# Altium schematic sheet NNP-DWG-125-001-000 PG4 Schematic Drawing Pg4.SchDoc: 1
size B; Address1: 300 Artini St.; Address2: Oberlin, OH  44074; DocumentNumber: 51-2002-01; Revision: 04; SheetNumber: 4; SheetTotal: 8; PageSetup: Record=PageOptions|CenterHorizontal=True|CenterVertical=True|PrintScale=1.09|XCorrection=1.00|YCorrection=1.00|PrintKind=0|BorderSize=5000000|LeftOffset=0|BottomOffset=0|Orientation=2|PaperLength=4318|PaperWidth=2794|Scale=100|PaperSource=7|PrintQuality=-3|MediaType=1|DitherType=10|PrintScaleMode=1|PaperKind=11" x 17"|PaperIndex=17; DocName: **
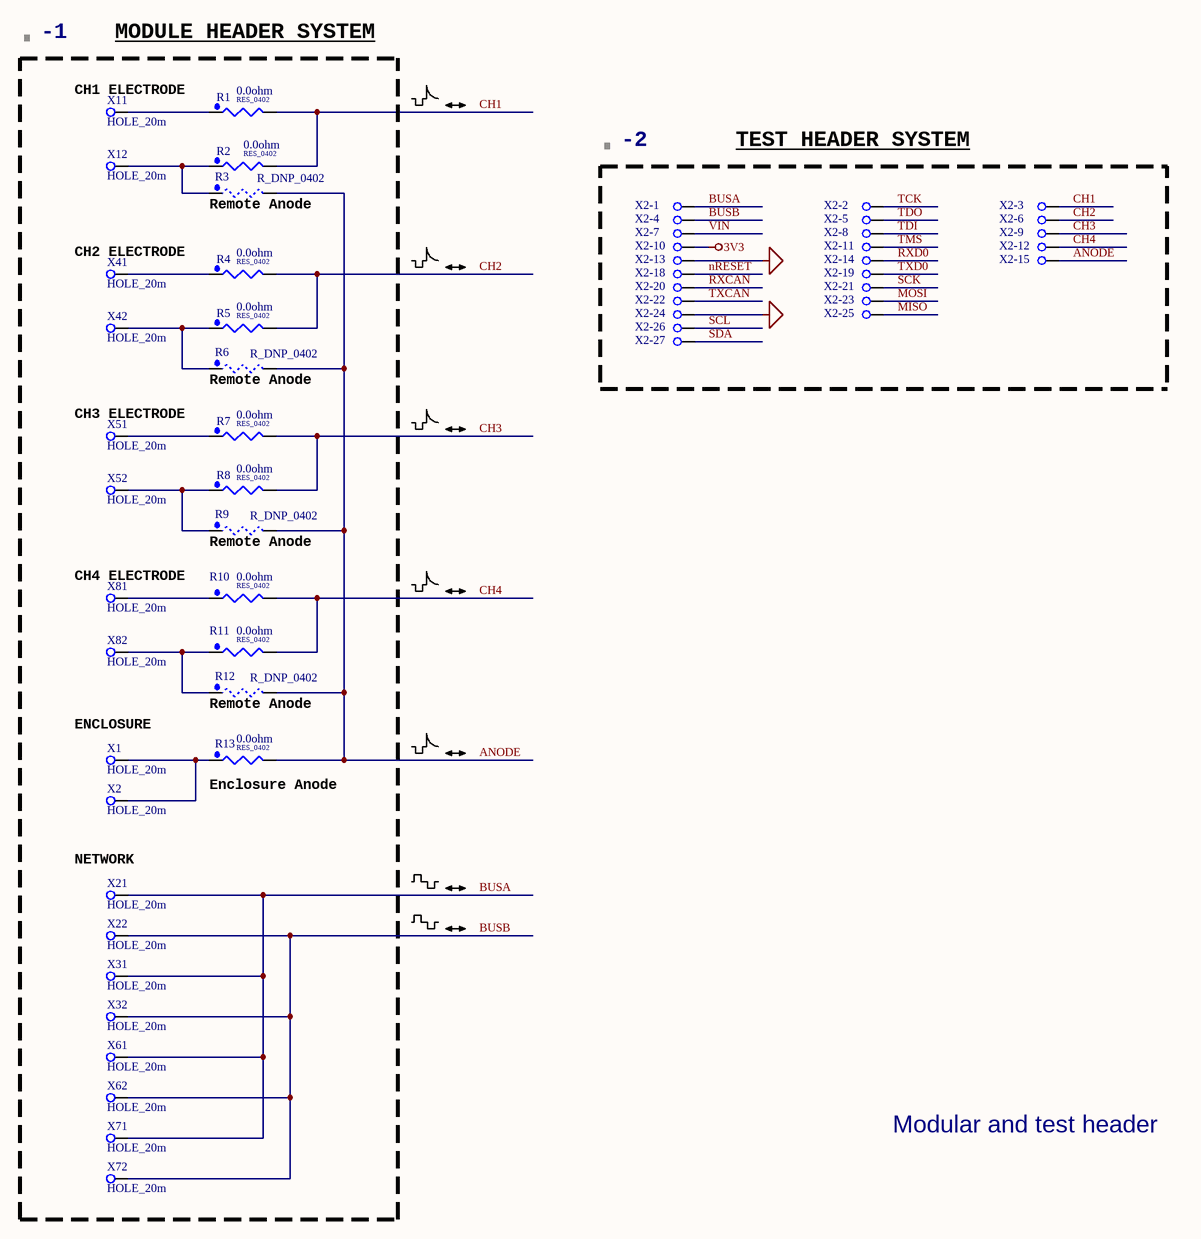
[diagram p0: NNP-DWG-125-001-000 PG4 Schematic Drawing Pg4.SchDoc]

## Parts
-1  XDESCRIPTION: MODULE HEADER SYSTEM  (hidden comment: BOM_S1)  (no BOM)
-2  XDESCRIPTION: TEST HEADER SYSTEM  (hidden comment: BOM_S1)  (no BOM)
R1  value 0.0ohm  [RES_0402]  (hidden comment: R_0_0402)
R2  value 0.0ohm  [RES_0402]  (hidden comment: R_0_0402)
R3  R_DNP_0402  [RES_0402]  (no BOM)
R4  value 0.0ohm  [RES_0402]  (hidden comment: R_0_0402)
R5  value 0.0ohm  [RES_0402]  (hidden comment: R_0_0402)
R6  R_DNP_0402  [RES_0402]  (no BOM)
R7  value 0.0ohm  [RES_0402]  (hidden comment: R_0_0402)
R8  value 0.0ohm  [RES_0402]  (hidden comment: R_0_0402)
R9  R_DNP_0402  [RES_0402]  (no BOM)
R10  value 0.0ohm  [RES_0402]  (hidden comment: R_0_0402)
R11  value 0.0ohm  [RES_0402]  (hidden comment: R_0_0402)
R12  R_DNP_0402  [RES_0402]  (no BOM)
R13  value 0.0ohm  [RES_0402]  (hidden comment: R_0_0402)
X1  HOLE_20m  [FEEDHOLE_20mil]  (no BOM)
X2  HOLE_20m  [FEEDHOLE_20mil]  (no BOM)
X2-1  0.1" header hole  [HDR_HOLE_RING]  (value not drawn)  (no BOM)
X2-2  0.1" header hole  [HDR_HOLE_RING]  (value not drawn)  (no BOM)
X2-3  0.1" header hole  [HDR_HOLE_RING]  (value not drawn)  (no BOM)
X2-4  0.1" header hole  [HDR_HOLE_RING]  (value not drawn)  (no BOM)
X2-5  0.1" header hole  [HDR_HOLE_RING]  (value not drawn)  (no BOM)
X2-6  0.1" header hole  [HDR_HOLE_RING]  (value not drawn)  (no BOM)
X2-7  0.1" header hole  [HDR_HOLE_RING]  (value not drawn)  (no BOM)
X2-8  0.1" header hole  [HDR_HOLE_RING]  (value not drawn)  (no BOM)
X2-9  0.1" header hole  [HDR_HOLE_RING]  (value not drawn)  (no BOM)
X2-10  0.1" header hole  [HDR_HOLE_RING]  (value not drawn)  (no BOM)
X2-11  0.1" header hole  [HDR_HOLE_RING]  (value not drawn)  (no BOM)
X2-12  0.1" header hole  [HDR_HOLE_RING]  (value not drawn)  (no BOM)
X2-13  0.1" header hole  [HDR_HOLE_RING]  (value not drawn)  (no BOM)
X2-14  0.1" header hole  [HDR_HOLE_RING]  (value not drawn)  (no BOM)
X2-15  0.1" header hole  [HDR_HOLE_RING]  (value not drawn)  (no BOM)
X2-18  0.1" header hole  [HDR_HOLE_RING]  (value not drawn)  (no BOM)
X2-19  0.1" header hole  [HDR_HOLE_RING]  (value not drawn)  (no BOM)
X2-20  0.1" header hole  [HDR_HOLE_RING]  (value not drawn)  (no BOM)
X2-21  0.1" header hole  [HDR_HOLE_RING]  (value not drawn)  (no BOM)
X2-22  0.1" header hole  [HDR_HOLE_RING]  (value not drawn)  (no BOM)
X2-23  0.1" header hole  [HDR_HOLE_RING]  (value not drawn)  (no BOM)
X2-24  0.1" header hole  [HDR_HOLE_RING]  (value not drawn)  (no BOM)
X2-25  0.1" header hole  [HDR_HOLE_RING]  (value not drawn)  (no BOM)
X2-26  0.1" header hole  [HDR_HOLE_RING]  (value not drawn)  (no BOM)
X2-27  0.1" header hole  [HDR_HOLE_RING]  (value not drawn)  (no BOM)
X11  HOLE_20m  [FEEDHOLE_20mil]  (no BOM)
X12  HOLE_20m  [FEEDHOLE_20mil]  (no BOM)
X21  HOLE_20m  [FEEDHOLE_20mil]  (no BOM)
X22  HOLE_20m  [FEEDHOLE_20mil]  (no BOM)
X31  HOLE_20m  [FEEDHOLE_20mil]  (no BOM)
X32  HOLE_20m  [FEEDHOLE_20mil]  (no BOM)
X41  HOLE_20m  [FEEDHOLE_20mil]  (no BOM)
X42  HOLE_20m  [FEEDHOLE_20mil]  (no BOM)
X51  HOLE_20m  [FEEDHOLE_20mil]  (no BOM)
X52  HOLE_20m  [FEEDHOLE_20mil]  (no BOM)
X61  HOLE_20m  [FEEDHOLE_20mil]  (no BOM)
X62  HOLE_20m  [FEEDHOLE_20mil]  (no BOM)
X71  HOLE_20m  [FEEDHOLE_20mil]  (no BOM)
X72  HOLE_20m  [FEEDHOLE_20mil]  (no BOM)
X81  HOLE_20m  [FEEDHOLE_20mil]  (no BOM)
X82  HOLE_20m  [FEEDHOLE_20mil]  (no BOM)

## Nets
3V3: X2-10.1
GND: X2-13.1 X2-24.1
ANODE: R3.2 R6.2 R9.2 R12.2 R13.2 X2-15.1
BUSA: X2-1.1 X21.1 X31.1 X61.1 X71.1
BUSB: X2-4.1 X22.1 X32.1 X62.1 X72.1
CH1: R1.2 R2.2 X2-3.1
CH2: R4.2 R5.2 X2-6.1
CH3: R7.2 R8.2 X2-9.1
CH4: R10.2 R11.2 X2-12.1
MISO: X2-25.1
MOSI: X2-23.1
nRESET: X2-18.1
RXCAN: X2-20.1
RXD0: X2-14.1
SCK: X2-21.1
SCL: X2-26.1
SDA: X2-27.1
TCK: X2-2.1
TDI: X2-8.1
TDO: X2-5.1
TMS: X2-11.1
TXCAN: X2-22.1
TXD0: X2-19.1
VIN: X2-7.1
NetR1_1: R1.1 X11.1
NetR2_1: R2.1 R3.1 X12.1
NetR4_1: R4.1 X41.1
NetR5_1: R5.1 R6.1 X42.1
NetR7_1: R7.1 X51.1
NetR8_1: R8.1 R9.1 X52.1
NetR10_1: R10.1 X81.1
NetR11_1: R11.1 R12.1 X82.1
NetR13_1: R13.1 X1.1 X2.1

## Notes on the sheet
- (near X11) CH1 ELECTRODE
- (near R3) Remote Anode
- (near X41) CH2 ELECTRODE
- (near R6) Remote Anode
- (near X51) CH3 ELECTRODE
- (near X81) CH4 ELECTRODE
- (near R9) Remote Anode
- (near X1) ENCLOSURE
- (near R12) Remote Anode
- (near R13) Enclosure Anode
- (near X21) NETWORK
- Modular and test header
- SALES RIGHTS REGARDING SAME ARE EXPRESSLY RESERVED.
- THIS DOCUMENT IS THE PROPERTY OF SYNAPSE BIOMEDICAL INC. AND MAY NOT BE
- USED, REPRODUCED, PUBLISHED OR DISCLOSED TO OTHERS WITHOUT EXPRESSED
- CONFIDENTIAL, PROPRIETARYDESIGN AND ALL DESIGN, MANUFACTURING, USE AND
- WRITTEN AUTHORIZATION BY SYNAPSE BIOMEDICAL INC. THIS DRAWING EMBODIES A
- DOCUMENT NAME
- SIZE
- B
- DOCUMENT NUMBER
- SHEET
- OF
- REV.

## Library data of the parts
-1 -2 = BOM_S1: BOM item small graphic
R1 R2 R4 R5 R7 R8 R10 R11 R13 = MCR01MZPJ000: 0.0 ohm, 1/16W, 0402, RoHS; MFR: Vishay Dale; MPN: CRCW04020000Z0ED; VTPN: RC0000-BI006RC8; SBI: 53-0048; NNPN: 00-11-1000; PackageDescription: RES_0402; Supplier 1: Digi-Key; Supplier Part Number 1: 541-0.0JDKR-ND
R3 R6 R9 R12 = R_DNP_0402: 0.0 ohm 1/16W smd 0402 RoHS; MFR: DO NOT POPULATE; MPN: DO NOT POPULATE; PackageDescription: RES_0402
X1 X2 X11 X12 X21 X22 X31 X32 X41 X42 X51 X52 X61 X62 X71 X72 X81 X82 = HOLE_20m: Hole for 10mil diameter feedthrough; Note: Hole for 10mil diameter feedthrough; PackageDescription: Thru-Hole
X2-1-X2-15 X2-18-X2-27 = Header 1x1: PackageDescription: Thru-Hole